# Altium schematic sheet schematic-medibox.SchDoc: MEDIBOX
size A3; DrawnBy: KKhang; DocumentNumber: 0; Revision: 0; SheetNumber: 1; SheetTotal: 2
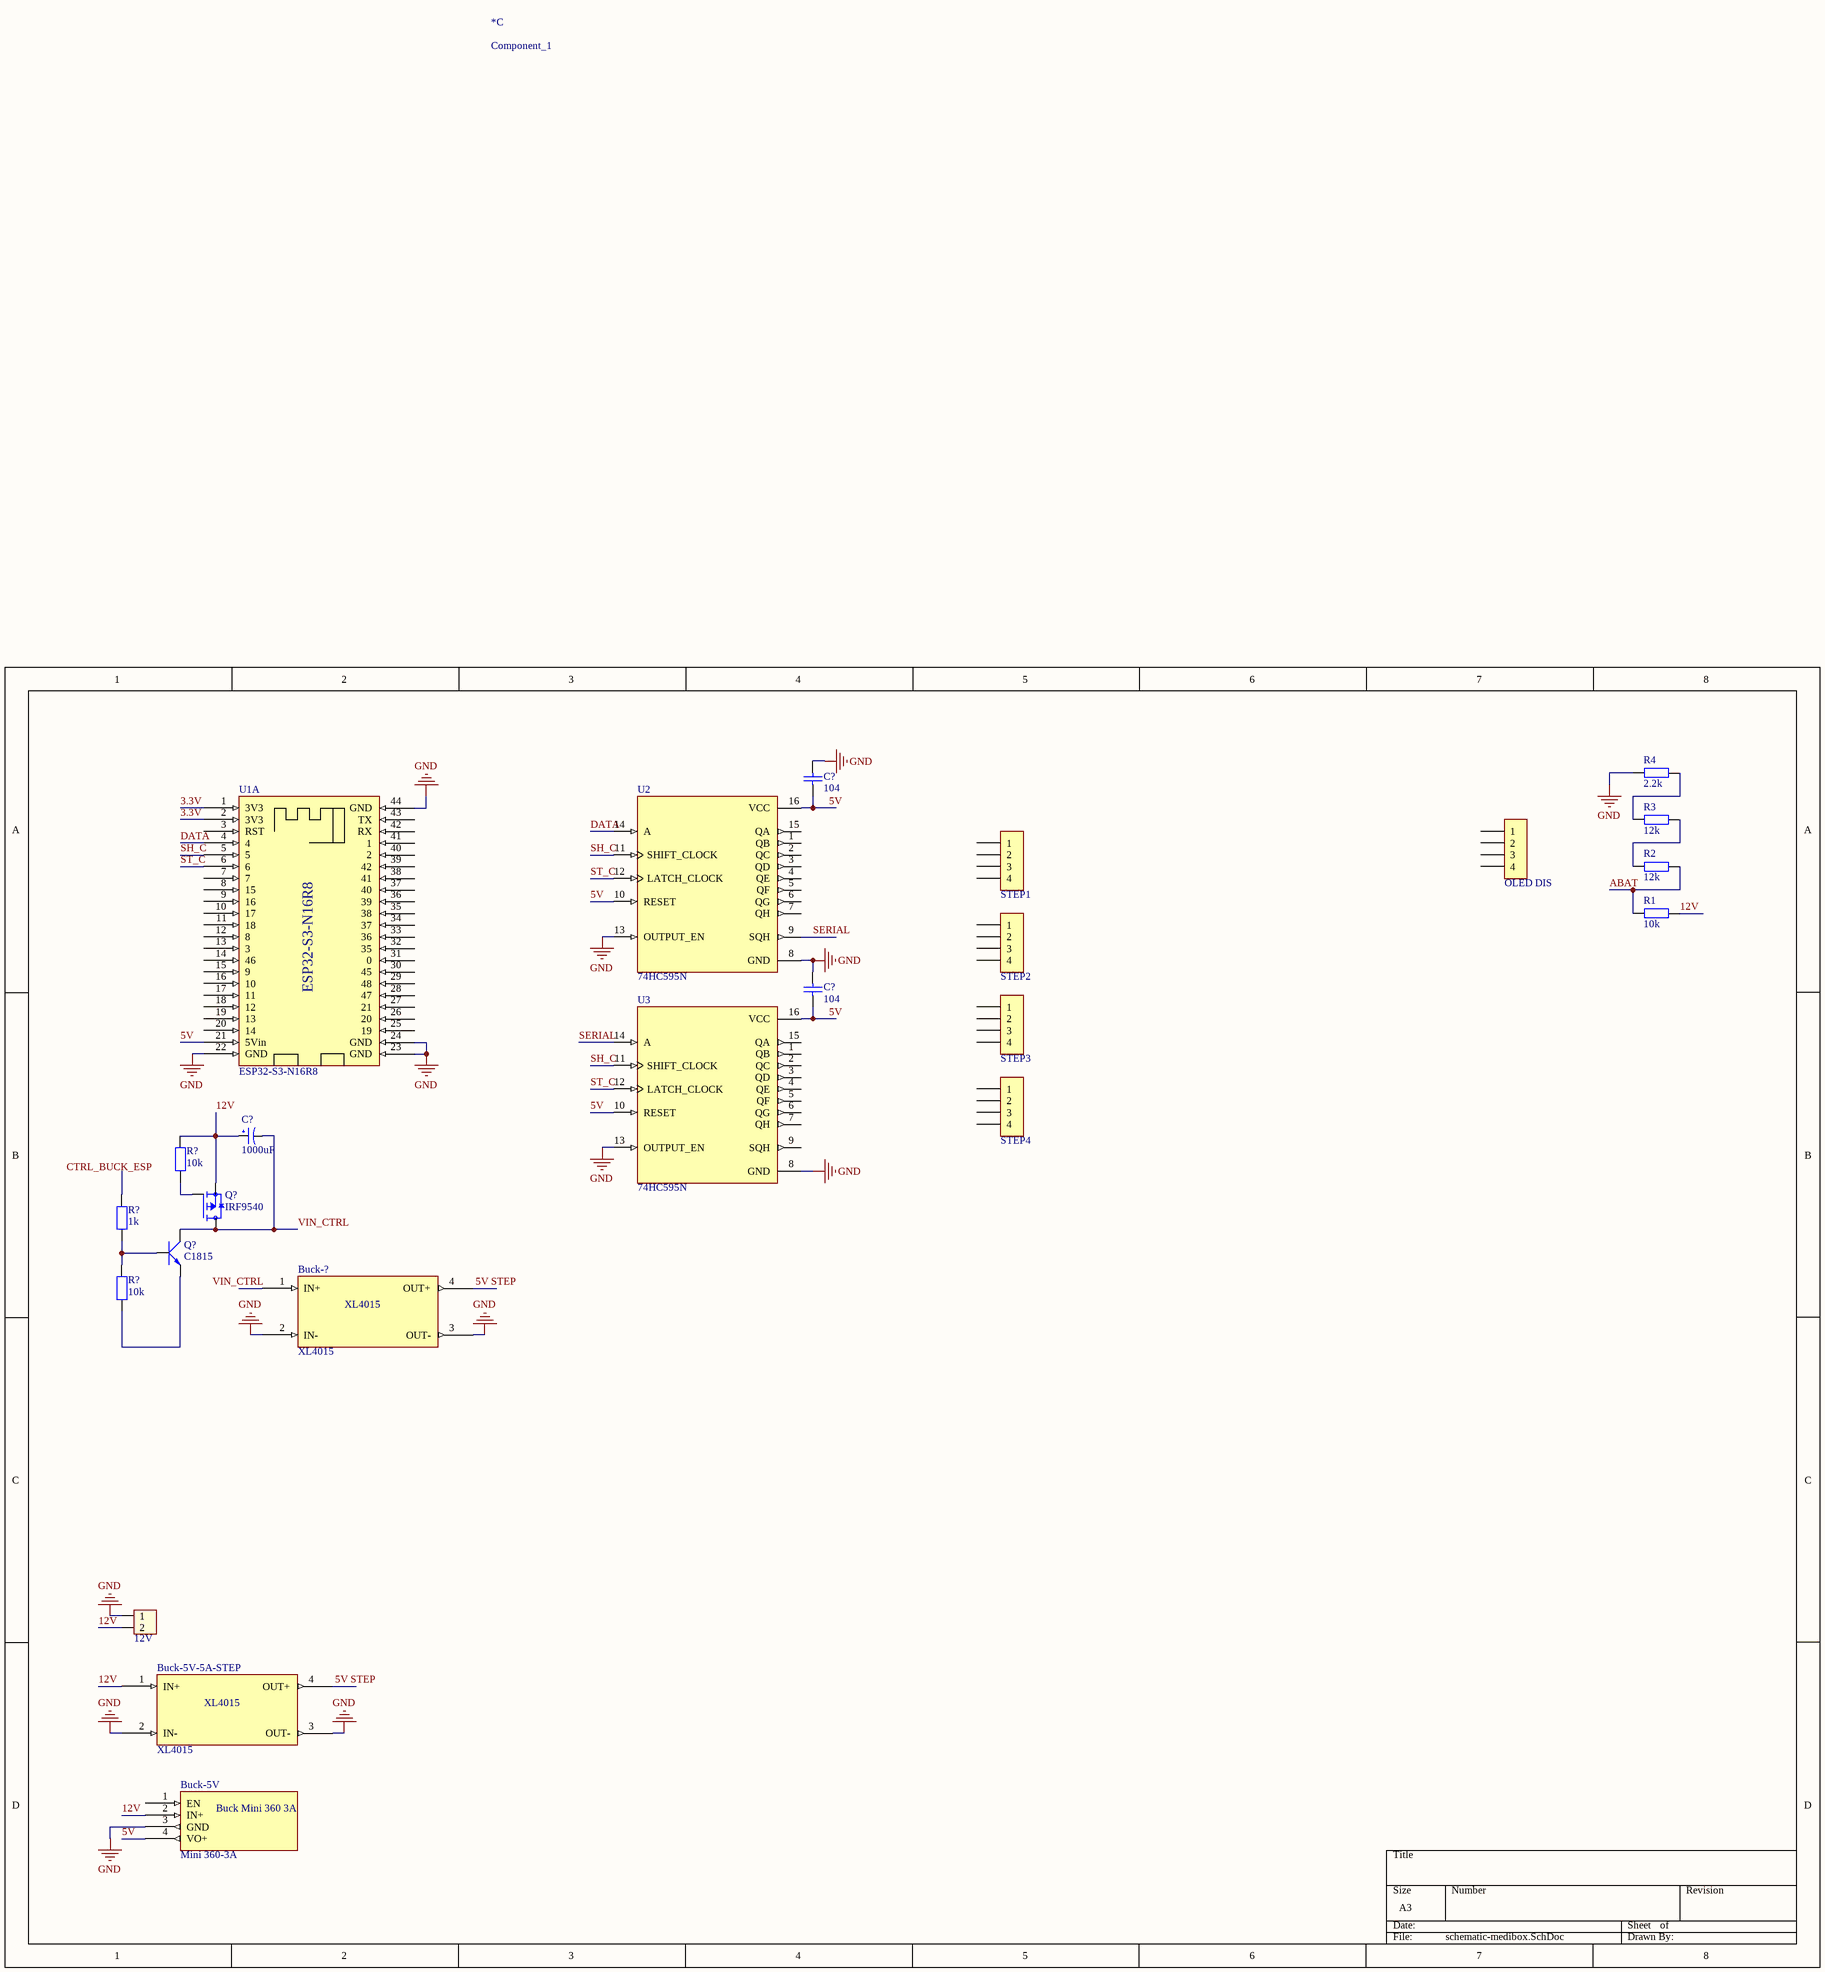
[diagram p0: schematic-medibox.SchDoc]

## Parts
(Parts that share a designator on the sheet are numbered #1, #2 ... from top to bottom, then left to right.)
*  Component_1  (part C of 4)
Buck-5V  Mini 360-3A  [PCBComponent_1]
Buck-5V-5A-STEP  XL4015  [DIP4]
Buck-?  XL4015  [DIP4]
C?#1  104  [tu gom]
C?#2  104  [tu gom]
C?#3  1000uF  [tu hoa 8mm]
H?#1  OLED DIS  [XH2.54M-4]
H?#2  STEP1  [XH2.54M-4]
H?#3  STEP2  [XH2.54M-4]
H?#4  STEP3  [XH2.54M-4]
H?#5  STEP4  [XH2.54M-4]
H?#6  12V  [XH2.54M-2]
Q?#1  IRF9540  [TO254P1052X465X1989-3]
Q?#2  C1815  [TO92]
R1  10k  [tro vach 1/4w]
R2  12k  [tro vach 1/4w]
R3  12k  [tro vach 1/4w]
R4  2.2k  [tro vach 1/4w]
R?#1  10k  [tro vach 1/4w]
R?#2  1k  [tro vach 1/4w]
R?#3  10k  [tro vach 1/4w]
U1  ESP32-S3-N16R8  [ESP32-S3-N16R8]  (part A of 4)
U2  74HC595N  [DIP762W48P254L1920H400Q16]
U3  74HC595N  [DIP762W48P254L1920H400Q16]

## Nets
GND: Buck-5V.3(GND) Buck-5V-5A-STEP.2(IN-) Buck-5V-5A-STEP.3(OUT-) Buck-?.2(IN-) Buck-?.3(OUT-) C?#1.1 C?#2.1 H?#6.1 R4.2 U1.22(GND) U1.23(GND) U1.24(GND) U1.44(GND) U2.8(GND) U2.13(OUTPUT_EN) U3.8(GND) U3.13(OUTPUT_EN)
3.3V: U1.1(3V3) U1.2(3V3)
5V: Buck-5V.4(VO+) C?#1.2 C?#2.2 U1.21(5Vin) U2.10(RESET) U2.16(VCC) U3.10(RESET) U3.16(VCC)
5V STEP: Buck-5V-5A-STEP.4(OUT+) Buck-?.4(OUT+)
12V: Buck-5V.2(IN+) Buck-5V-5A-STEP.1(IN+) C?#3.1 H?#6.2 Q?#1.3(S) R1.1 R?#1.2
ABAT: R1.2 R2.1
DATA: U1.4 U2.14(A)
SERIAL: U2.9(SQH) U3.14(A)
SH_C: U1.5 U2.11(SHIFT_CLOCK) U3.11(SHIFT_CLOCK)
ST_C: U1.6 U2.12(LATCH_CLOCK) U3.12(LATCH_CLOCK)
VIN_CTRL: Buck-?.1(IN+) C?#3.2 Q?#1.2(D) Q?#2.2(C)
NetQ?#1_1: Q?#1.1(G) R?#1.1
NetQ?#2_1: Q?#2.1(E) R?#3.1
NetQ?#2_3: Q?#2.3(B) R?#2.2 R?#3.2
NetR2_2: R2.2 R3.1
NetR3_2: R3.2 R4.1

Not connected (* = marked no-connect by the designer): Buck-5V 1(EN); H?#1 1 2 3 4; H?#2 1 2 3 4; H?#3 1 2 3 4; H?#4 1 2 3 4; H?#5 1 2 3 4; R?#2 1; U1 3(RST) 7 8(15) 9(16) 10(17) 11(18) 12(8) 13(3) 14(46) 15(9) 16(10) 17(11) 18(12) 19(13) 20(14) 25(19) 26(20) 27(21) 28(47) 29(48) 30(45) 31(0) 32(35) 33(36) 34(37) 35(38) 36(39) 37(40) 38(41) 39(42) 40(2) 41(1) 42(RX) 43(TX); U2 1(QB) 2(QC) 3(QD) 4(QE) 5(QF) 6(QG) 7(QH) 15(QA); U3 1(QB) 2(QC) 3(QD) 4(QE) 5(QF) 6(QG) 7(QH) 9(SQH) 15(QA)

## Notes on the sheet
- Labels drawn without touching a wire or pin: CTRL_BUCK_ESP
- (in symbol Mini 360-3A) Buck Mini 360 3A

## Library data of the parts
C?#1 C?#2 = Tu gom 104 50V: Cắm; So_Chan: 2; Ten_Linh_Kien: Tụ gốm 104 100nF 50V; Don_Vi: Con; Ma_Hang: MH004761; Chung_Loai: Cắm; Kieu_Chan: *
C?#3 = Tu Hoa 1000uF 16V 8x20: Cắm; Don_Vi: Con; So_Chan: 2; Ten_Linh_Kien: Tụ Hóa 1000uF 16V 8x20MM; Ma_Hang: MH008300; Chung_Loai: Cắm; Kieu_Chan: *
H?#1-H?#5 = Header 4P 2.54 Duc Thang: Cắm; Ten_Linh_Kien: Header 4P XH2.54-4P Đực Thẳng; Don_Vi: Con; Ma_Hang: MH001285; Chung_Loai: Cắm
H?#6 = Header 2P 2.54 Duc Thang: Cắm; Ten_Linh_Kien: Header 2P XH2.54-2P Đực Thẳng; Don_Vi: Con; Ma_Hang: MH001283; Chung_Loai: Cắm
Q?#1 = IRF9540: P-Channel 100 V 19A (Tc) 3.7W (Ta), 150W (Tc) Surface Mount DÂ²PAK (TO-263); MF: Vishay; SnapEDA_Link: https://www.snapeda.com/parts/IRF9540/Vishay+Siliconix/view-part/?ref=snap; Package: TO-220-3 Vishay; Value: *; MP: IRF9540; Check_prices: https://www.snapeda.com/parts/IRF9540/Vishay+Siliconix/view-part/?ref=eda
Q?#2 = Trans C1815 DIP: NPN transistor; Value: C9014
R1 R?#1 R?#3 = Tro Vach 1/4W 5% 10k: Căm; Chung_Loai: Cắm; Don_Vi: Con; So_Chan: 2; Ten_Linh_Kien: Trở Vạch 1/4w 5% 10K; Ma_Hang: MH007354; Kieu_Chan: *
R2 R3 = Tro Vach 1/4W 5% 12k: Cắm; Don_Vi: Con; So_Chan: 2; Ma_Hang: MH007389; Ten_Linh_Kien: Trở Vạch 1/4w 5% 12k; Chung_Loai: Cắm; Kieu_Chan: *
R4 = Tro Vach 1/4W 5% 2.2k: Cắm; Don_Vi: Con; So_Chan: 2; Ten_Linh_Kien: Trở Vạch 1/4w 5% 2.2k; Ma_Hang: MH007293; Chung_Loai: Cắm; Kieu_Chan: *
R?#2 = Tro Vach 1/4W 5% 1k: Cắm; Don_Vi: Con; So_Chan: 2; Ten_Linh_Kien: Trở Vạch 1/4w 5% 1k; Ma_Hang: MH007390; Chung_Loai: Cắm; Kieu_Chan: *
U1 = ESP32-S3-N16R8: ESP32-S3-DEVKITC-1
U2 U3 = 74HC595N: 8-bit Shift Registers with Latched 3-State Outputs; MF: TAEJIN; SnapEDA_Link: https://www.snapeda.com/parts/74HC595N/TAEJIN/view-part/?ref=snap; Package: DIP-16 TAEJIN; Value: *; MP: 74HC595N; Check_prices: https://www.snapeda.com/parts/74HC595N/TAEJIN/view-part/?ref=eda